# EAGLE design Humidity Shield v1 (EAGLE 5.11)
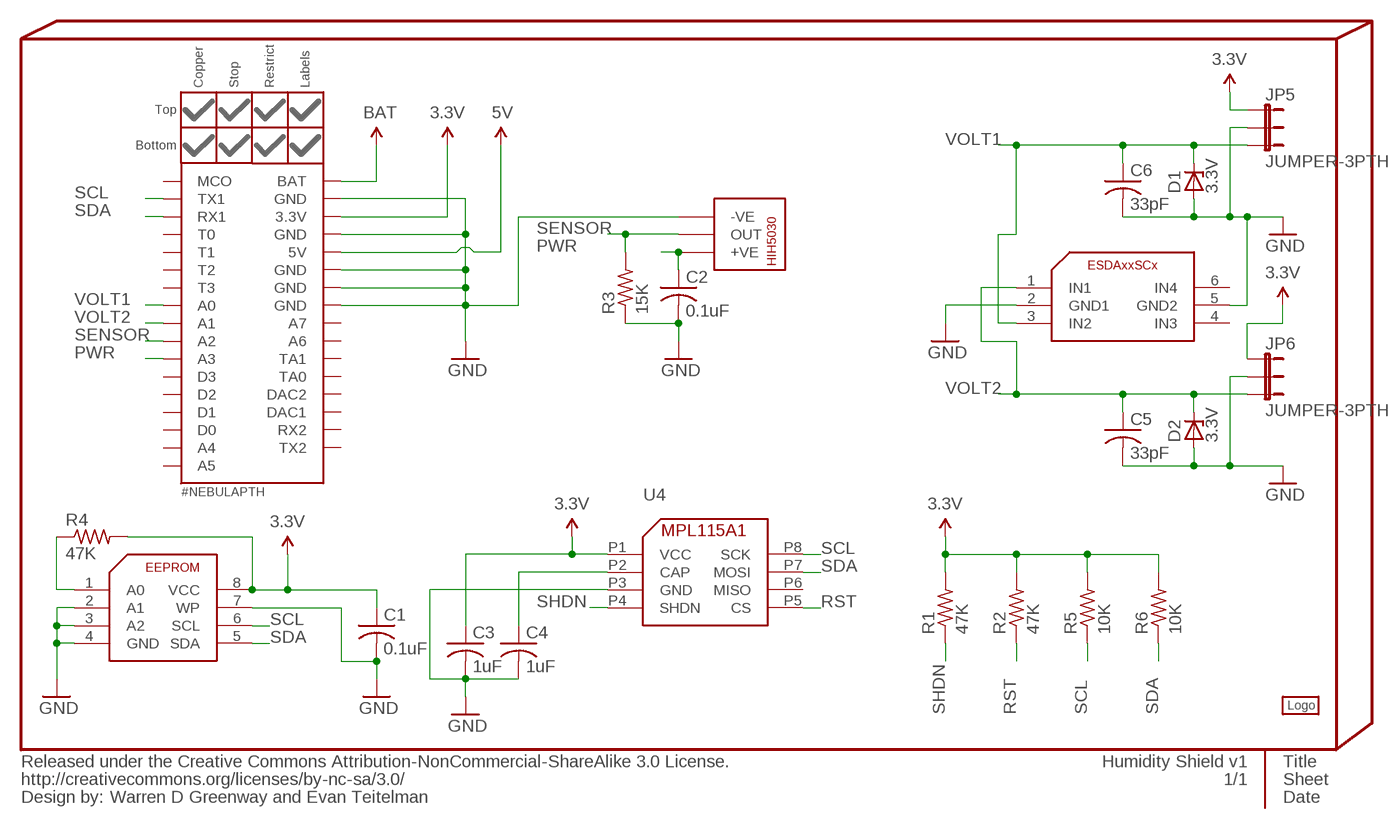
[diagram p0: schematic, sheet 1]

## Parts
C1  0.1uF  C-USC0402  [C0402]
C2  0.1uF  C-USC0402  [C0402]
C3  1uF  C-USC0402  [C0402]
C4  1uF  C-USC0402  [C0402]
C5  33pF  C-USC0402  [C0402]
C6  33pF  C-USC0402  [C0402]
D1  3.3V  ZENER-DIODESOD80C  [SOD80C]
D2  3.3V  ZENER-DIODESOD80C  [SOD80C]
INFO2  Warren D Greenway and Evan Teitelman  %CC-NC-SA  [%CC-NC-SA]
JP5  JUMPER-3PTH  [1X03]
JP6  JUMPER-3PTH  [1X03]
LOGO1  #LOGOA-THICK  [#LOGOA-THICK]
NEBULA1  #NEBULAPTH  [#NEBULA-PTH]
NEBULAPART1  #NEBULA-PARTLABELS-BOTTOM  [#NEBULA-LABELS-BOTT]
R1  47K  R-US_R0402  [R0402]
R2  47K  R-US_R0402  [R0402]
R3  15K  R-US_R0402  [R0402]
R4  47K  R-US_R0402  [R0402]
R5  10K  R-US_R0402  [R0402]
R6  10K  R-US_R0402  [R0402]
U1  ESDAXXSC6  [SOT23-6L]
U2  HIH-5030  [HIH-5030]
U3  EEPROM-ATMEL-AT24HC02B  [TSSOP8]
U4  PRESSURE-FREESCALE-MPL115A1  [LGA8]

## Nets
3.3V: C1.1 C3.1 JP5.1 JP6.1 NEBULA1.3.3V R1.2 R2.2 R4.2 R5.2 R6.2 U3.8(VCC) U4.P1(VCC) ; supply symbol labelled @3.3V
5V: NEBULA1.5V ; supply symbol labelled @5V
BAT: NEBULA1.BAT ; supply symbol labelled @BAT
GND: C1.2 C2.2 C3.2 C4.2 C5.2 C6.2 D1.A D2.A JP5.2 JP6.2 NEBULA1.GND1(GND) NEBULA1.GND2(GND) NEBULA1.GND3(GND) NEBULA1.GND4(GND) NEBULA1.GND5(GND) R3.1 U1.2(GND1) U1.5(GND2) U2.P$2(-VE) U3.2(A1) U3.3(A2) U3.4(GND) U3.7(WP) U4.P3(GND) ; supply symbol labelled @GND
N$1: R4.1 U3.1(A0)
N$2: C4.1 U4.P2(CAP)
PWR: C2.1 NEBULA1.A3 U2.P$4(+VE)
RST: R2.1 U4.P5(CS)
SCL: NEBULA1.COM1_TX(TX1) R5.1 U3.6(SCL) U4.P8(SCK)
SDA: NEBULA1.COM1_RX(RX1) R6.1 U3.5(SDA) U4.P7(MOSI)
SENSOR: NEBULA1.A2 R3.2 U2.P$3(OUT)
SHDN: R1.1 U4.P4(SHDN)
VOLT1: C6.1 D1.C JP5.3 NEBULA1.A0 U1.3(IN2)
VOLT2: C5.1 D2.C JP6.3 NEBULA1.A1 U1.1(IN1)
Unconnected: NEBULA1.A4 NEBULA1.A5 NEBULA1.A6 NEBULA1.A7 NEBULA1.COM2_RX(RX2) NEBULA1.COM2_TX(TX2) NEBULA1.D0 NEBULA1.D1 NEBULA1.D2 NEBULA1.D3 NEBULA1.DAC1 NEBULA1.DAC2 NEBULA1.MCO NEBULA1.T0 NEBULA1.T1 NEBULA1.T2 NEBULA1.T3 NEBULA1.TA0 NEBULA1.TA1 U1.4(IN3) U1.6(IN4) U4.P6(MISO)

## Library data of the parts
C1-C6 = rcl:C-US: CAPACITOR, American symbol
D1 D2 = diode:ZENER-DIODE: Z-Diode
INFO2 = PygmyBoards:%CC-NC-SA: Released under the Creative Commons Attribution-NonCommercial-ShareAlike 3.0 License. http://creativecommons.org/licenses/by-sa/3.0 Design by: [Designer Name] Change this part's value to change the designer name
JP5 JP6 = SparkFun:JUMPER-3
LOGO1 = PygmyBoards:#LOGO
NEBULA1 = PygmyBoards:#NEBULA: Nebula Board and Shield Footprint Pads This is the only absolutely required part for the footprint. The parts in "#NEBULA-PART" are merely aesthetic. A circular board outline should be .001" thick and 1.005" in diameter (Reference circle on the Document (48) layer provided).
NEBULAPART1 = PygmyBoards:#NEBULA-PART: Nebula Board and Shield Footprint Parts These parts are only functional when combined with the pads in "#NEBULA".
R1-R6 = rcl:R-US_: RESISTOR, American symbol
U1 = Pygmy:ESDAXXSC6
U2 = Pygmy:HIH-5030
U3 = Pygmy:EEPROM-ATMEL-AT24HC02B
U4 = Pygmy:PRESSURE-FREESCALE-MPL115A1

## Board
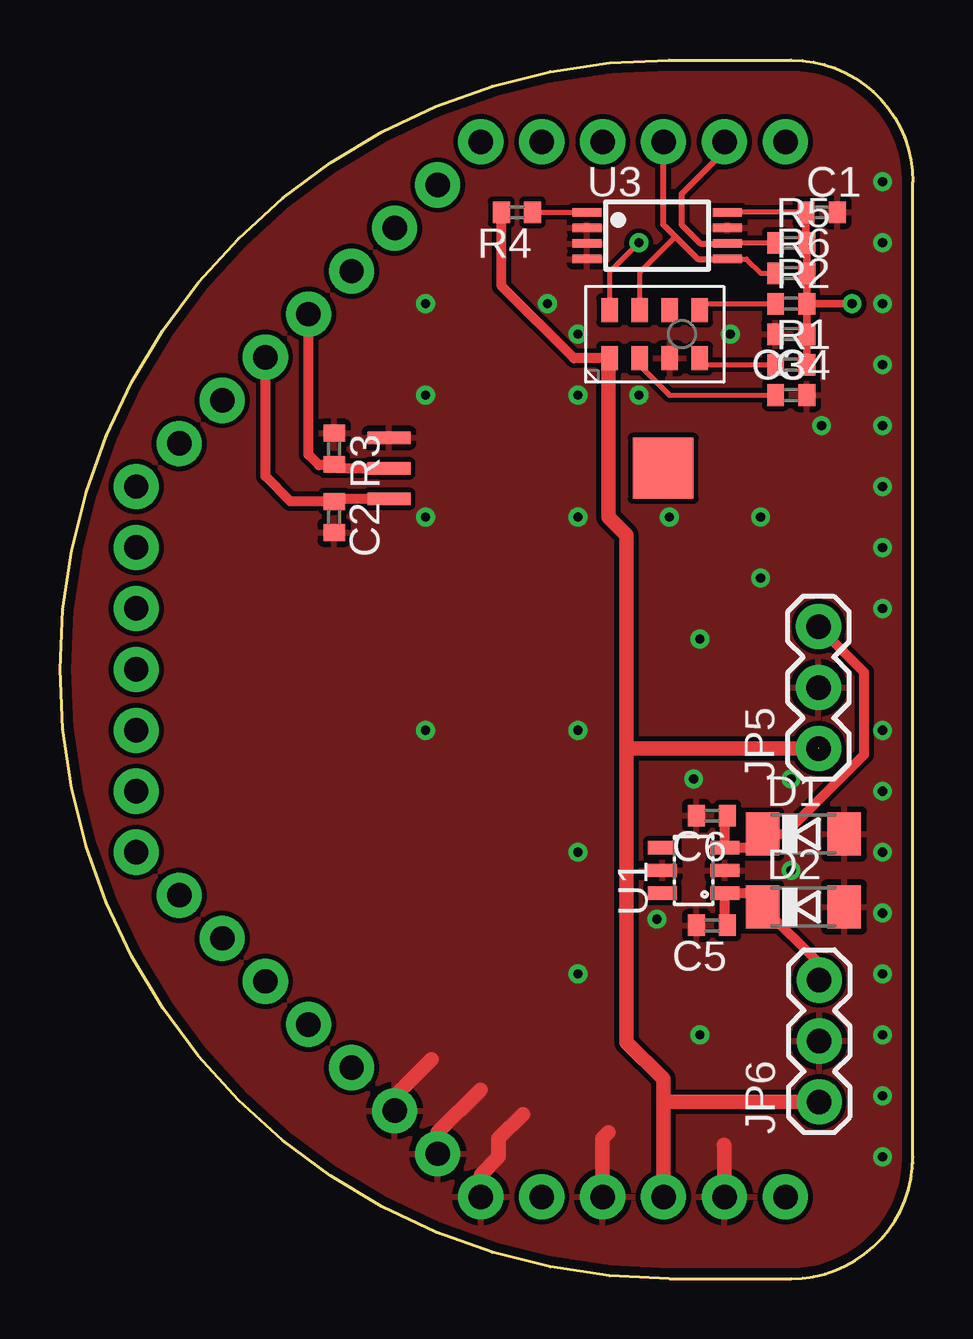
[diagram p1: board, top side]
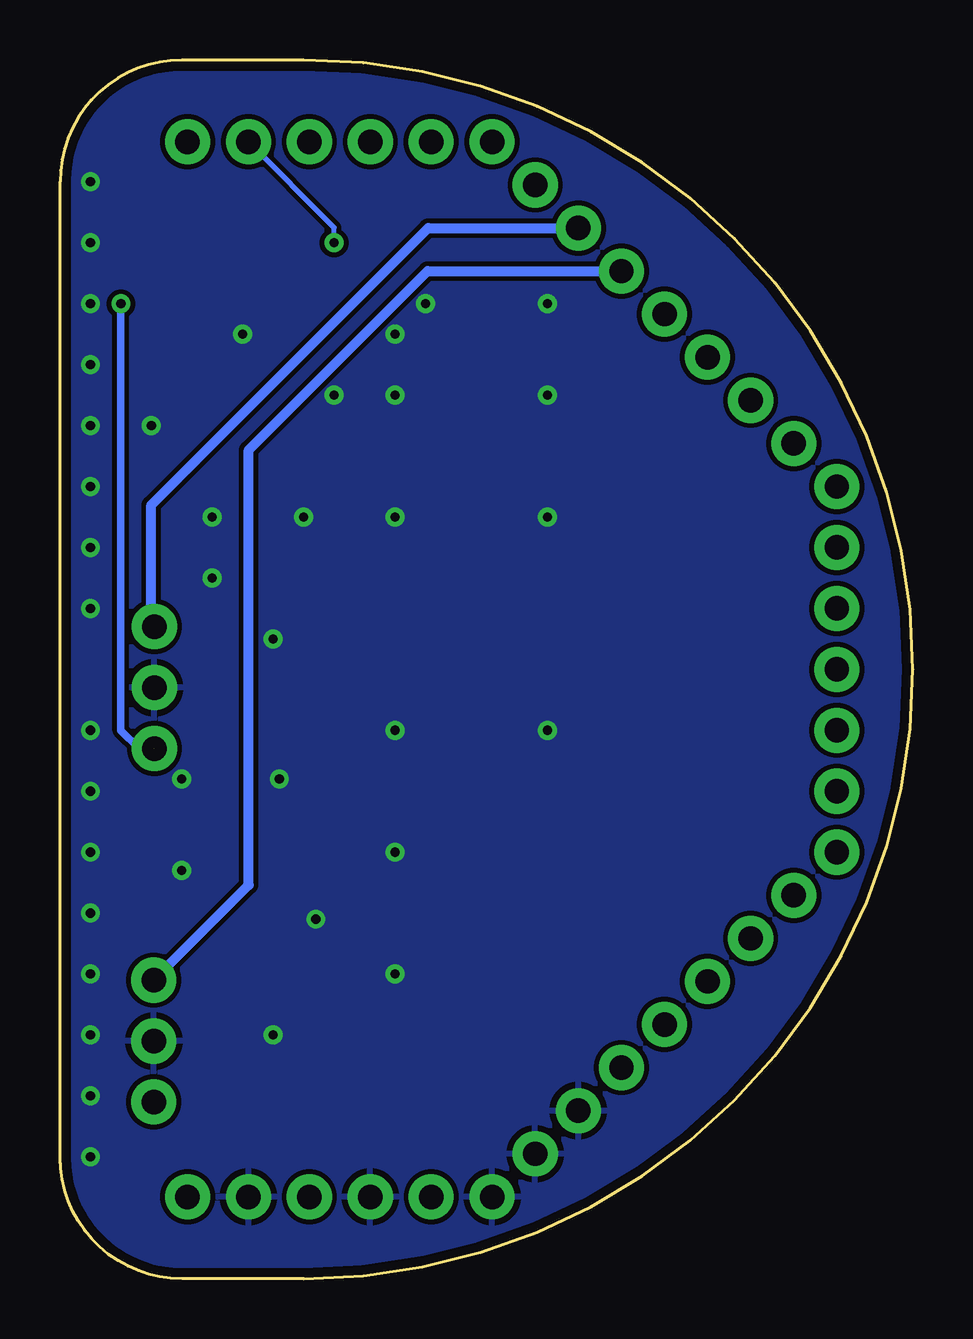
[diagram p2: board, bottom side, seen from below]

Size 35.56 x 50.8 mm. Coordinates in mm from the lower left corner, seen from the top.
Outline: 35.56,4.83 35.56,5.08
Outline: 35.56,5.08 35.56,45.72 arc90 30.48,50.8 25.4,50.8 arc180 25.4,0 30.48,0 arc90 35.56,5.08
Copper layers (1*16): Top 0.035mm / dielectric 1.5mm / Bottom 0.035mm
Design rules "PDX (Production)": minimum track width 6mil, minimum drill 15mil, track to track 6mil, track to pad 6mil, pad to pad 4mil, via to via 6mil, smd to smd 4mil, copper to edge 15mil, drill to drill 6mil, minimum pad ring 10mil, minimum via ring 8mil, stop-mask expansion 4mil, vias tented up to drill 25mil, thermal gap 10mil

### Footprints (pad centres in the part's own frame; a part is rotated, then mirrored left to right if it is on the bottom)
C0402 = smd 0.7 x 0.9: 1 -0.65,0; 2 0.65,0
SOD80C = smd 1.4 x 1.8: A 1.7,0; C -1.7,0
1X03 = drill 1.016 pad 1.88 round: 1 0,0; 2 2.54,0; 3 5.08,0
#NEBULA-PTH@1 = drill 1.016 pad 1.88 round: 3.3V -25.637,-47.388; 5V -30.716,-47.388; A0 -36.848,-7.004; A1 -38.645,-8.8; A2 -40.44,-10.596; A3 -42.237,-12.392; A4 -47.625,-22.86; A5 -47.625,-25.4; A6 -40.44,-40.204; A7 -38.645,-42; BAT -20.557,-47.388; COM1_RX -25.636,-3.412; COM1_TX -23.096,-3.412; COM2_RX -47.625,-30.48; COM2_TX -47.625,-27.94; D0 -47.625,-20.32; D1 -47.625,-17.78; D2 -45.829,-15.984; D3 -44.032,-14.188; DAC1 -47.625,-33.02; DAC2 -45.829,-34.816; GND1 -36.848,-43.796; GND2 -35.052,-45.592; GND3 -33.256,-47.388; GND4 -28.177,-47.388; GND5 -23.097,-47.388; MCO -20.556,-3.412; T0 -28.176,-3.412; T1 -30.716,-3.412; T2 -33.256,-3.412; T3 -35.052,-5.208; TA0 -44.032,-36.612; TA1 -42.237,-38.408
R0402 = smd 0.7 x 0.9: 1 -0.65,0; 2 0.65,0
SOT23-6L = smd 0.55 x 1.2: 1 -0.95,-1.3; 2 0,-1.3; 3 0.95,-1.3; 4 0.95,1.3; 5 0,1.3; 6 -0.95,1.3
HIH-5030 = smd 2.54 x 2.54: P$1 0,0 | smd 0.508 x 1.778: P$2 -1.27,-11.43; P$3 0,-11.43; P$4 1.27,-11.43
TSSOP8 = smd 1.2 x 0.35: 1 -2.925,0.975; 2 -2.925,0.325; 3 -2.925,-0.325; 4 -2.925,-0.975; 5 2.925,-0.975; 6 2.925,-0.325; 7 2.925,0.325; 8 2.925,0.975
LGA8 = smd 1 x 0.7: P1 -1,3.75; P2 -1,2.5; P3 -1,1.25; P4 -1,0; P5 1,0; P6 1,1.25; P7 1,2.5; P8 1,3.75

### Placement (x,y rotation side)
C1  31.75,44.45 0 top
C2  11.43,31.75 270 top
C3  30.48,39.37 180 top
C4  30.48,36.83 0 top
C5  27.18,14.73 180 top
C6  27.18,19.3 180 top
D1  30.99,18.54 0 top
D2  30.99,15.49 0 top
INFO2  -2.54,-10.16 0 top  (outside the outline)
JP5  31.62,22.1 90 top
JP6  31.65,7.37 90 top
LOGO1  10.16,25.4 270 top
NEBULA1  #NEBULAPTH  [#NEBULA-PTH@1]  50.8,50.8 0 top
NEBULAPART1  50.8,50.8 0 top  (outside the outline)
R1  30.48,38.1 0 top
R2  30.48,40.64 0 top
R3  11.43,34.59 270 top
R4  19.05,44.45 180 top
R5  30.48,43.18 0 top
R6  30.48,41.91 0 top
U1  26.42,17.02 90 top
U2  25.15,33.78 270 top
U3  24.89,43.48 0 top
U4  26.67,39.37 90 top

### Tracks (layer width: path | path; a pad name or v marks a point on that pad's centre or on a via)
3.3V  (via drill 0.38)  (1 unrouted)
  Top 0.203: U3.8 C1.1 | R5.2 31.1,43.21
  Top 0.305: 31.1,43.21 C1.1 | R5.2 R6.2 R2.2 | R1.2 C3.1 R2.2 | v33.02,40.64 R2.2
  Top 0.406: U4.P1 21.42,38.37 18.41,41.38 18.41,44.44 R4.2
  Top 0.61: U4.P1 22.86,38.31 22.86,31.75 23.62,30.99 23.62,22.17 | 23.62,22.17 23.62,9.85 25.15,8.32 25.15,7.29 | 31.64,22.1 23.7,22.1 23.62,22.17 | 25.15,3.43 25.15,7.29 | JP6.1 25.22,7.37 25.15,7.29
  Top 1.016: NEBULA1.3.3V 25.15,3.43
  Bottom 0.305: 32.26,22.1 33.02,22.86 v33.02,40.64
  Bottom 0.61: JP5.1 32.26,22.1
GND  (via drill 0.38)
  Top 0.61: NEBULA1.GND1 13.95,7.6 15.49,9.14 | NEBULA1.GND2 15.75,6.1 17.53,7.87 | NEBULA1.GND3 17.54,4.34 18.29,5.08 18.29,5.84 19.3,6.86 | NEBULA1.GND5 27.7,5.57 27.69,5.59 | NEBULA1.GND4 22.62,5.86 22.86,6.1
  other vias: 34.29,22.86 34.29,12.7 34.29,10.16 26.67,10.16 30.48,17.02 26.42,20.83 24.89,14.99 31.75,35.56 21.59,12.7 26.67,26.67 34.29,35.56 15.24,40.64 34.29,45.72 34.29,43.18 34.29,38.1 34.29,40.64 29.21,31.75 30.48,20.83 34.29,17.78 21.59,36.83 20.32,40.64 24.13,36.83 15.24,36.83 34.29,33.02 21.59,17.78 27.94,39.37 34.29,7.62 34.29,15.24 34.29,20.32 34.29,30.48 34.29,27.94 29.21,29.21 34.29,5.08 15.24,22.86 21.59,22.86 21.59,39.37 25.4,31.75 15.24,31.75 21.59,31.75
  pour Bottom (isolate 0.203): -2.54,-2.54 41.91,-2.54 41.91,53.34 -2.54,53.34
  pour Top (isolate 0.203): -1.27,-1.27 41.91,-1.27 41.91,52.07 -1.27,52.07
N$1
  Top 0.203: U3.1 R4.1
N$2
  Top 0.203: C4.1 25.4,36.83 24.13,38.1 24.13,38.33 U4.P2
PWR
  Top 0.406: NEBULA1.A3 8.56,33.45 9.6,32.41 C2.1 11.54,32.51 U2.P$4
RST
  Top 0.203: R2.1 26.94,40.64 U4.P5
SCL  (via drill 0.38)
  Top 0.203: R5.1 27.84,43.18 U3.6 | U4.P8 22.92,41.97 v24.13,43.18
  Top 0.254: U3.6 26.7,43.15 25.91,43.94 25.91,45.21 27.43,46.74 27.43,47.12 NEBULA1.COM1_TX
  Bottom 0.203: v24.13,43.18 24.13,43.81 NEBULA1.COM1_TX
SDA
  Top 0.203: U3.5 28.62,42.5 29.21,41.91 R6.1 | U4.P7 24.17,41.95 25.65,43.43
  Top 0.254: U3.5 26.59,42.5 25.65,43.43 25.15,43.94 25.15,47.37 NEBULA1.COM1_RX
SENSOR
  Top 0.406: NEBULA1.A2 10.36,34.34 10.8,33.91 11.39,33.91 R3.2 11.59,33.78 U2.P$3
SHDN
  Top 0.203: R1.1 26.94,38.1 U4.P4
VOLT1
  Top 0.406: C6.1 27.72,19.19 U1.3 27.73,17.98 28.78,17.98 29.29,18.49 D1.C 30.23,18.54 33.53,21.84 33.53,25.27 JP5.3
  Bottom 0.406: NEBULA1.A0 20.21,43.8 31.75,32.26 31.75,27.3 JP5.3
VOLT2
  Top 0.406: C5.1 27.72,14.84 U1.1 28.78,16.08 29.29,15.57 D2.C 31.65,13.13 JP6.3
  Bottom 0.406: NEBULA1.A1 20.23,42 27.69,34.54 27.69,16.41 JP6.3

### Text on the board
tTest: S | S
bTest: V1 | Pygmy Nebula | Warren D Greenway | Design By: | Humidity Shield | Evan Teitelman
Document: Pygmy Humidity Shield | Version 1.0 | Standard Grid: 50mil | Routing Grids: 8mil / 4mil